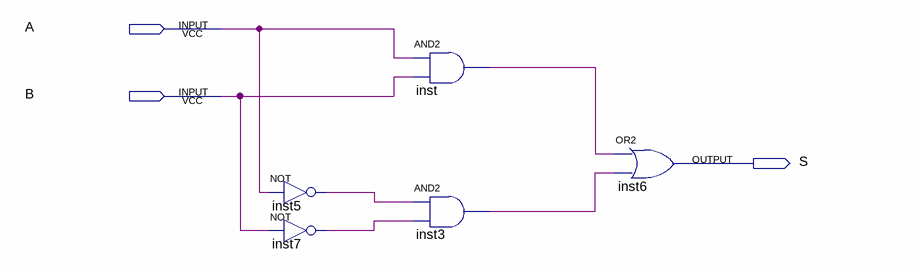
[diagram p0: schematic sheet]
// Quartus schematic EqualsBox.bdf as structural Verilog: 5 symbols, 3 pins
module EqualsBox (
  input  A,
  input  B,
  output S
);

  wire inst3_out, inst5_out, inst7_out, inst_out;

  not inst5 (inst5_out, A);
  not inst7 (inst7_out, B);
  and inst (inst_out, A, B);
  and inst3 (inst3_out, inst5_out, inst7_out);
  or inst6 (S, inst_out, inst3_out);
endmodule
